# Altium schematic sheet Sheet_1_2022-01-22.schdoc
size 49 x 31 mm
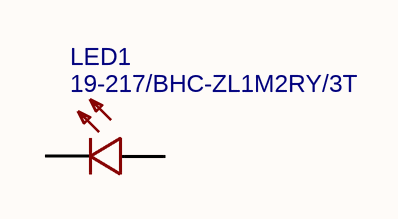
[diagram p0: Sheet_1_2022-01-22.schdoc]

## Parts
LED1  19-217/BHC-ZL1M2RY/3T  [LED0603-R-RD_BLUE]

## Nets

Not connected (* = marked no-connect by the designer): LED1 1(A) 2(C)

## Library data of the parts
LED1 = 19-217/BHC-ZL1M2RY/3T: BOM_Manufacturer: EVERLIGHT; BOM_Supplier: LCSC; BOM_Manufacturer Part: 19-217/BHC-ZL1M2RY/3T; BOM_Supplier Part: C72041; BOM_JLCPCB Part Class: Basic Part; spicePre: L; spiceSymbolName: 19-217/BHC-ZL1M2RY/3T